# Altium schematic sheet Amplification.SchDoc
size A4; SheetNumber: 3; SheetTotal: 5
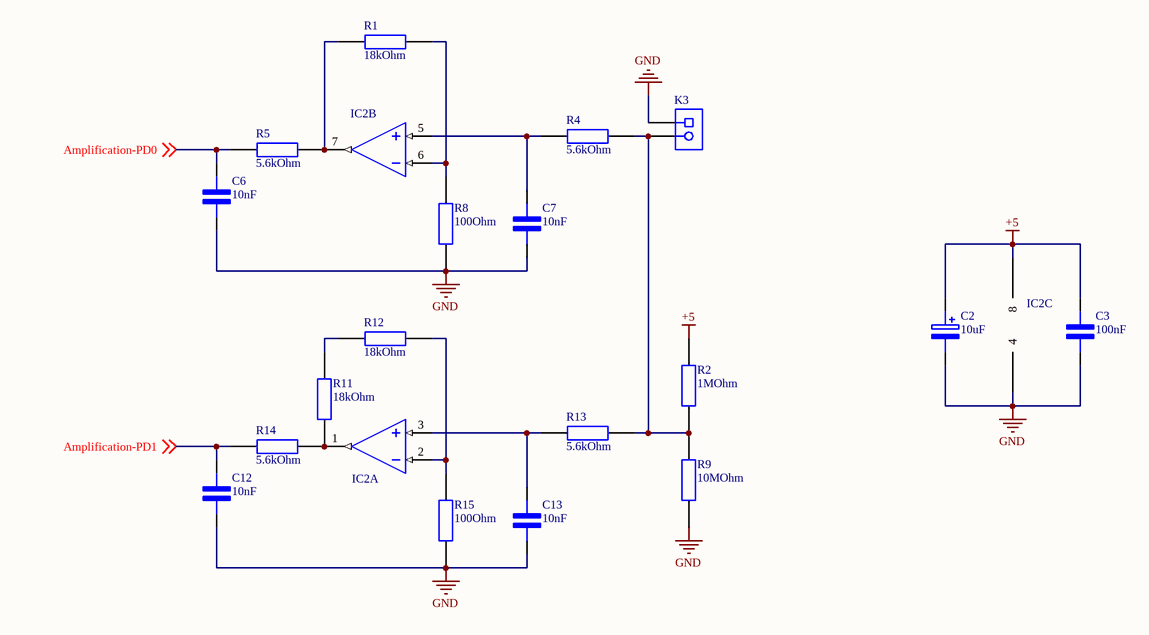
[diagram p0: Amplification.SchDoc]

## Parts
C2  10uF  [10uF capacitor]
C3  100nF  [5mm lead spacing capacitor]
C6  10nF  [5mm lead spacing capacitor]
C7  10nF  [5mm lead spacing capacitor]
C12  10nF  [5mm lead spacing capacitor]
C13  10nF  [5mm lead spacing capacitor]
IC2  MCP6002-E/P  [DIP8E]  (value not drawn)  (parts A,B,C of 3)
K3  1729128  [2-pin terminal block]  (value not drawn)
R1  18kOhm  [resistor]
R2  1MOhm  [resistor]
R4  5.6kOhm  [resistor]
R5  5.6kOhm  [resistor]
R8  100Ohm  [resistor]
R9  10MOhm  [resistor]
R11  18kOhm  [resistor]
R12  18kOhm  [resistor]
R13  5.6kOhm  [resistor]
R14  5.6kOhm  [resistor]
R15  100Ohm  [resistor]

## Nets
+5: C2.1(+) C3.2(-) IC2.8 R2.2
GND: C2.2(-) C3.1(+) C6.1(+) C7.1(+) C12.1(+) C13.1(+) IC2.4 K3.1 R8.1 R9.1 R15.1
Amplification-PD0: C6.2(-) R5.1 ; off-sheet Amplification-PD0
Amplification-PD1: C12.2(-) R14.1 ; off-sheet Amplification-PD1
NetC7_2: C7.2(-) IC2.5(VINB+) R4.2
NetC13_2: C13.2(-) IC2.3(VINA+) R13.1
NetIC2_1: IC2.1(VOUTA) R11.1 R14.2
NetIC2_2: IC2.2(VINA-) R12.2 R15.2
NetIC2_6: IC2.6(VINB-) R1.2 R8.2
NetIC2_7: IC2.7(VOUTB) R1.1 R5.2
NetK3_2: K3.2 R2.1 R4.1 R9.2 R13.2
NetR11_2: R11.2 R12.1

## Library data of the parts
C2 = 10uF capacitor: Capacitor Polarised; Manufacturer_Name: Panasonic; Manufacturer_Part_Number: ECA-1HM100B; Datasheet Link: https://componentsearchengine.com//ECA-1HM100B.pdf; Height: 12mm; Mouser2 Part Number: 667-ECA-1HM100B; Mouser2 Price/Stock: https://www.mouser.com/Search/Refine.aspx?Keyword=667-ECA-1HM100B
C3 = 100nF capacitor: Capacitor; Manufacturer_Name: Nichicon; Manufacturer_Part_Number: UVR1H472MRD; Datasheet Link: https://www.mouser.co.uk/datasheet/2/293/e-vr-6088.pdf; Height: 42mm
C6 C7 C12 C13 = 10nF capacitor: Capacitor; Manufacturer_Name: Nichicon; Manufacturer_Part_Number: UVR1H472MRD; Datasheet Link: https://www.mouser.co.uk/datasheet/2/293/e-vr-6088.pdf; Height: 42mm
IC2 = MCP6002-E/P: Dual Opamp; Slew Rate: 0.6V/µs; Supply Current: 100uA; Power Supply Rejection Ratio (PSRR): 86dB; Input Offset Voltage (Vos): 4.5mV; Input Bias Current: 1pA; Amplifier Type: GENERAL PURPOSE; Unity Gain Bandwidth Product: 1MHz; Number of Circuits: 2; Output Current: 23mA; Operating Supply Voltage: 5.5V; Min Supply Voltage: 1.8V; Common Mode Rejection Ratio: 60dB; Voltage Gain: 112dB; Max Supply Voltage: 6V; Package Quantity: 60; REACH SVHC: No SVHC; Min Operating Temperature: -40°C; Max Operating Temperature: 125°C; Mount: Through Hole; Nominal Supply Current: 100uA; Height: 3.3mm; Length: 9.27mm; Slew Rate-Nom: 0.6V/µs; Packaging: Rail/Tube; Output Current per Channel: 23mA; Number of Amplifiers: 2; RoHS Compliant: Yes; Radiation Hardening: No; Bandwidth: 1MHz; Lead Free: Lead Free; Width: 6.35mm; Number of Channels: 2; Gain Bandwidth Product: 1MHz; Technology: CMOS; Operating Supply Current: 100uA; Number of Elements: 2; Number of Pins: 8; Input Offset Voltage-Max: 4.5mV; Case/Package: PDIP
K3 = MKDSN 1,5/ 2-5,08: PCB Terminal Block, 13.5 A, 400 V, 2-Pin THD, RoHS, Bulk; Manufacturer: Phoenix Contact; Package Version: 03/2015; No. of Rows: 1; Pitch: 5.08mm; No. of Positions: 2; Voltage Rating: 400V; Current Rating: 13500mA; Manufacturer URL: http://www.phoenixcontact.com/; Datasheet URL: https://datasheet.ciiva.com/16046/1729128-16046181.pdf; RoHS: TRUE; Package URL: https://www.phoenixcontact.com/online/portal/pi/pxc/product_detail_page/!ut/p/b1/3VdJjqNKFDxLH8AFycySyWY2ozFsEPOMMQaDOX1XedGL_1Vdm5YXJleknhSKeBkvI6EA8ncAo3AYoDhBQGco6KN7VURTdemj9us_IEKEZo_YHiPAEWEFmDGOHMORkqKYCORBZxgL7ZoaZYcbFFUZ3fqxSY6GOuxydWUuHqz1ynmMFygu583Bob0Ewr6Sd_l-5m-kAueHiB0jpRwZwe58wwtkpxtMYd_LmGcDRU02dRNEyWt6Y2ti5pSyJ_reIkzIulrqApdnbT11V5jnCKbYNCvhEM1MCpPByat_X379-iThf08CI5GfOPqfBeS3BRoBOdD55AKVv0iLwCMq-2BrzXWSGRH7pUGD9uwXQjiph3xL0DKQwdGa0JImiIOmBNOestqgwTHSSs2oOep-78apyXQBvNi8ZLaFjvjWvcaUEBu0MC6Wbe-d6mB0FAebo2lUWinqYaZs5DAYzV0RP9yitUjnGJ0iI9xhZkT42OCQNUJJhkgWINNQLP2JFP6OpMg3JCVg70jqHT0lvKOnhHf0lPuOnnLf0VPuWx6_dxwUIvwk5WMkT0kLL1mh61l2yZVSzG3pYV_bqo-mj6uMKwKwdnnW8Jh5RTOJzMOA5c-eJDaZQw4mTMPH02PvS_ZAqNVjVTo2WyYLkwH_KU1mmmG5kjRhDqPXLwwVHvVOjCM60-fpXvTDfMGW1PVFVS1r4e4yVDk4ZdNbkUHvqPqQSeian4UD39fNKmachqdJ1NJbyk8rXT9mXTvPk3oE5meulKGgiruPJek-4I9hTT6G8ZLOyRSm2RRVbThERQad5OS28hdt4YW4vG0stgYYzsWsK4_7y6DZMjJSCqri1kyiZR5vD7pwIrNR7QwPHTcLTI5qT7eRlpHrdGiupYlqQDJ7zy_CND8fWWBoLRXxk1RVcXiBQwbTD4Xi7KL-FuO94t9xaqweXzH; PartNumber: 1729128; Package Description: 2-Pin Through Hole Device, Body 8.1 x 10.16 mm, Pitch 5.08 mm; Datasheet Version: 12/2013; Mounting Technology: ThroughHole; Orientation: Horizontal; Package Reference: 1729128-2; Packing: Bulk
R1 R11 R12 = 18kOhm resistor: Resistor; Manufacturer_Name: YAGEO (PHYCOMP); Manufacturer_Part_Number: CFR-25JT-52-10K
R2 = 1MOhm resistor: Resistor; Manufacturer_Name: Ohmite; Manufacturer_Part_Number: OK1055E-R52
R4 R5 R13 R14 = 5.6kOhm resistor: Resistor; Manufacturer_Name: YAGEO (PHYCOMP); Manufacturer_Part_Number: CFR-25JB-52-5K6; Datasheet Link: https://componentsearchengine.com//CFR-25JB-52-5K6.pdf; Mouser2 Part Number: 603-CFR-25JB-52-5K6; Mouser2 Price/Stock: https://www.mouser.com/Search/Refine.aspx?Keyword=603-CFR-25JB-52-5K6
R8 R15 = 100Ohm resistor: Resistor; Manufacturer_Name: YAGEO (PHYCOMP); Manufacturer_Part_Number: CFR-25JR-52-100R; Datasheet Link: https://componentsearchengine.com//CFR-25JR-52-100R.pdf; Mouser2 Part Number: 603-CFR-25JR-52100R; Mouser2 Price/Stock: https://www.mouser.com/Search/Refine.aspx?Keyword=603-CFR-25JR-52100R
R9 = 10MOhm resistor: Resistor; Manufacturer_Name: YAGEO (PHYCOMP); Manufacturer_Part_Number: CFR-25JT-52-10M; Datasheet Link: https://datasheet.datasheetarchive.com/originals/distributors/Datasheets_SAMA/cf5c7c7b14e59499e9125003e6ee5ce2.pdf